# EAGLE design DOORLOCK (EAGLE 7.5.0)
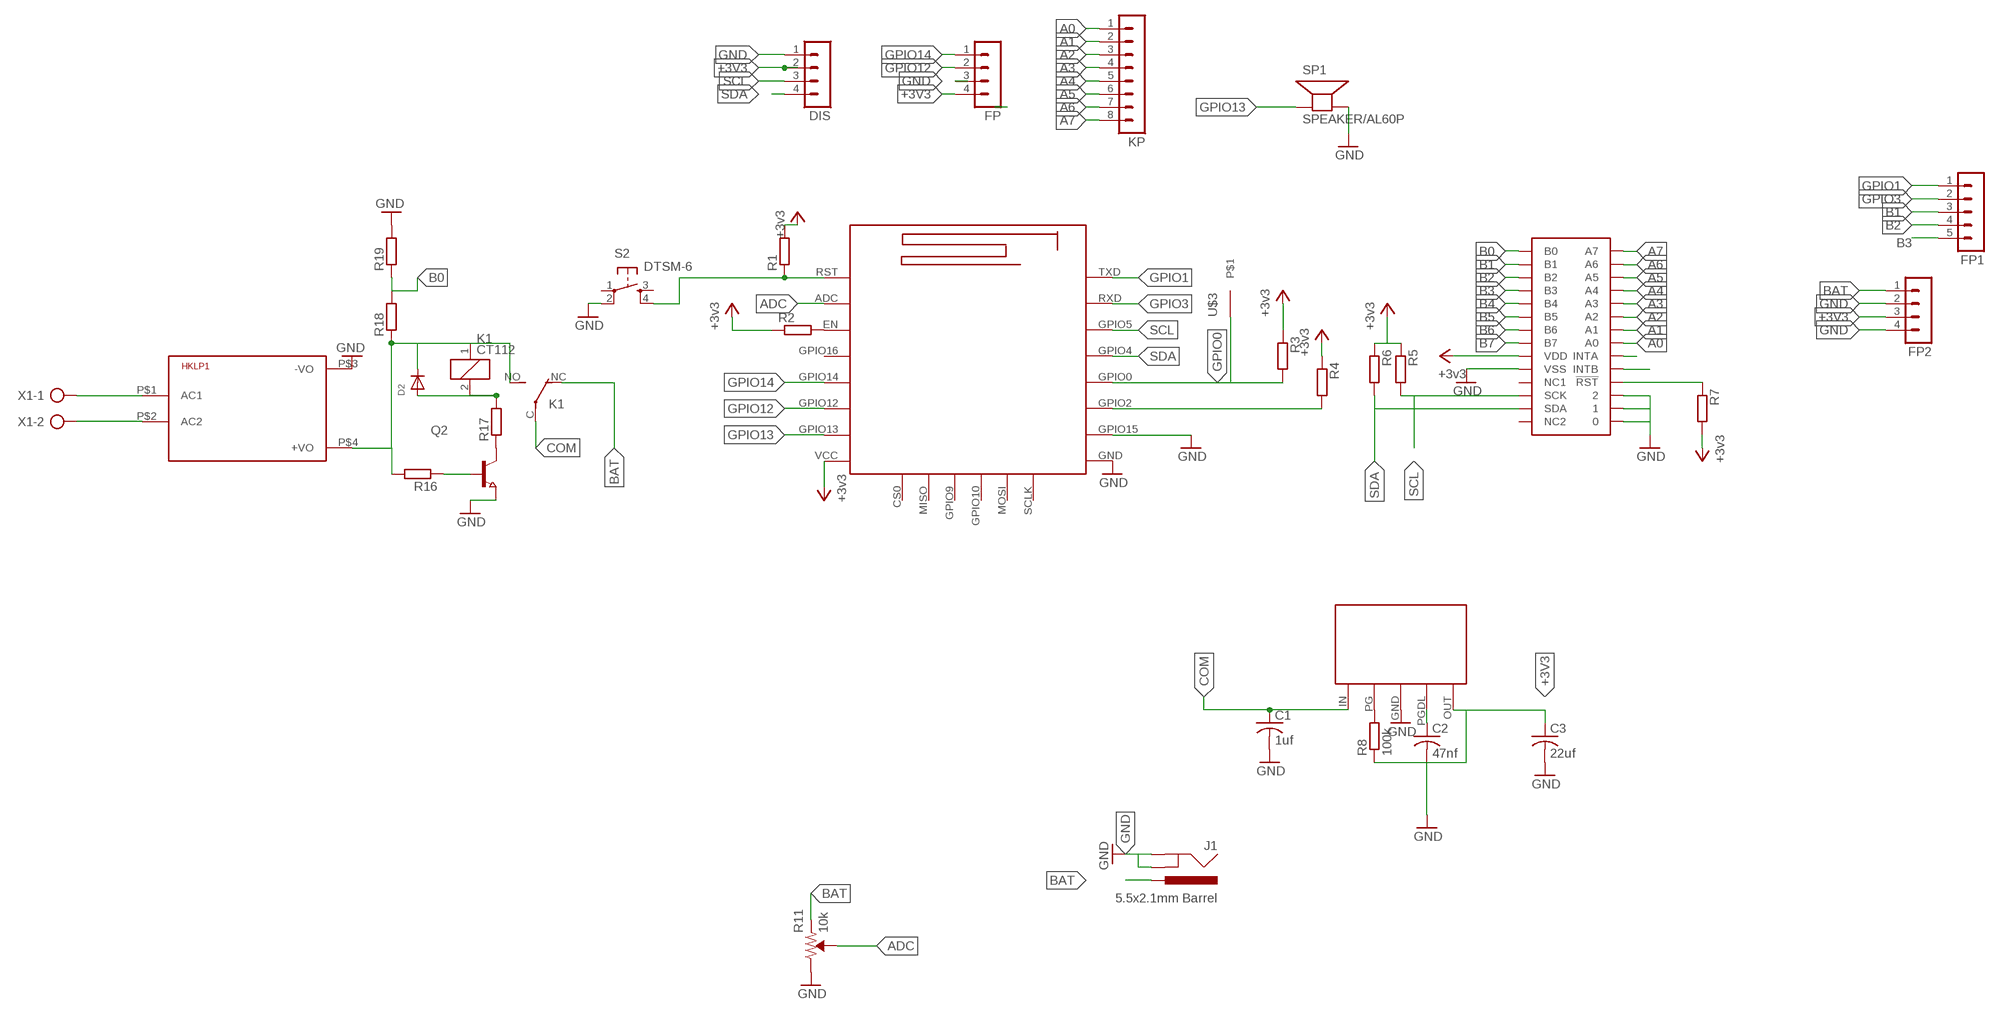
[diagram p0: schematic, sheet 1]

## Parts
C1  1uf  C-USC1206  [C1206]
C2  47nf  C-USC1206  [C1206]
C3  22uf  C-USC1206  [C1206]
D2  DIODESOD-123  [SOD-123]
DIS  MA04-1  [MA04-1]
FP  MA04-1  [MA04-1]
FP1  MA05-1  [MA05-1]
FP2  MA04-1  [MA04-1]
HKLP1  HKLPM01  [HKLPM01]
J1  5.5x2.1mm Barrel  POWER_JACKSMD  [POWER_JACK_SMD]
K1  CT112  [CT-SLIM]
KP  MA08-1  [MA08-1]
Q2  NPN-TRANSISTOR_SOT89  [SOT89]
R1  R-EU_0204/2V  [0204V]
R2  R-EU_0204/2V  [0204V]
R3  R-EU_0204/2V  [0204V]
R4  R-EU_0204/2V  [0204V]
R5  R-EU_0204/2V  [0204V]
R6  R-EU_0204/2V  [0204V]
R7  R-EU_0204/2V  [0204V]
R8  100k  R-EU_0204/2V  [0204V]
R11  10k  TRIMPOT-SMD-3MM-OPEN-1/10W-25%  [TRIMPOT-SMD-TC33X]
R16  R-EU_0204/2V  [0204V]
R17  R-EU_0204/2V  [0204V]
R18  R-EU_0204/2V  [0204V]
R19  R-EU_0204/2V  [0204V]
S2  DTSM-6  [DTSM-6]
SP1  SPEAKER/AL60P  [AL60P]
U$1  ESP12E  [ESP-12E]
U$2  MCF23017  [MAX23017]
U$3  M1  [M1]
U$4  MP2014  [MP2014]
X1  AK500/2-H  [AK500/2-H]

## Nets
+3V3 [GPIO]: C3.1 DIS.2 FP2.3 FP.4 R1.2 R2.1 R3.1 R4.1 R5.1 R6.1 R7.2 R8.1 U$1.VCC U$2.P$9(VDD) U$4.OUT ; supply symbol labelled +3v3
+12V: D2.C HKLP1.P$4(+VO) K1.1 K1.NO(2:S) R16.2 R18.1
A0 [GPIO]: KP.1 U$2.P$21(A0)
A1 [GPIO]: KP.2 U$2.P$22(A1)
A2 [GPIO]: KP.3 U$2.P$23(A2)
A3 [GPIO]: KP.4 U$2.P$24(A3)
A4 [GPIO]: KP.5 U$2.P$25(A4)
A5 [GPIO]: KP.6 U$2.P$26(A5)
A6 [GPIO]: KP.7 U$2.P$27(A6)
A7 [GPIO]: KP.8 U$2.P$28(A7)
ADC [GPIO]: R11.2(WIPER) U$1.ADC
B0 [GPIO]: R18.2 R19.1 U$2.P$1(B0)
B1 [GPIO]: FP1.3 U$2.P$2(B1)
B2 [GPIO]: FP1.4 U$2.P$3(B2)
B3 [GPIO]: FP1.5 U$2.P$4(B3)
B4 [GPIO]: U$2.P$5(B4)
B5 [GPIO]: U$2.P$6(B5)
B6 [GPIO]: U$2.P$7(B6)
B7 [GPIO]: U$2.P$8(B7)
BAT: FP2.1 J1.VIN0(PWR) K1.NC(2:O) R11.3(CCW)
COM: C1.1 K1.C(2:P) U$4.IN
GND [GPIO]: C1.2 C2.2 C3.2 DIS.1 FP2.2 FP2.4 FP.3 HKLP1.P$3(-VO) J1.GND(GNDBREAK) J1.P$4(GND) Q2.3(E) R11.1(CW) R19.2 S2.2 SP1.2(-) U$1.GND U$1.GPIO15 U$2.P$10(VSS) U$2.P$15 U$2.P$16 U$2.P$17 U$4.GND
GPIO0 [GPIO]: R3.2 U$1.GPIO0 U$3.P$1
GPIO1 [GPIO]: FP1.1 U$1.TXD
GPIO3 [GPIO]: FP1.2 U$1.RXD
GPIO12 [GPIO]: FP.2 U$1.GPIO12
GPIO13 [GPIO]: SP1.1(+) U$1.GPIO13
GPIO14 [GPIO]: FP.1 U$1.GPIO14
N$1 [GPIO]: R1.1 S2.4 U$1.RST
N$2: R2.2 U$1.EN
N$3 [AC]: HKLP1.P$1(AC1) X1.1
N$4 [GPIO]: R4.2 U$1.GPIO2
N$7 [AC]: HKLP1.P$2(AC2) X1.2
N$9: R7.1 U$2.P$18(!RST)
N$10: U$2.P$19(INTB)
N$11: U$2.P$20(INTA)
N$12: R8.2 U$4.PG
N$13: C2.1 U$4.PGDL
N$15: Q2.1(B) R16.1
N$16: Q2.2(C) R17.1
N$26: D2.A K1.2 R17.2
SCL [GPIO]: DIS.3 R5.2 U$1.GPIO5 U$2.P$12(SCK)
SDA [GPIO]: DIS.4 R6.2 U$1.GPIO4 U$2.P$13(SDA)
Unconnected: S2.1 S2.3 U$1.CS0 U$1.GPIO9 U$1.GPIO10 U$1.GPIO16 U$1.MISO U$1.MOSI U$1.SCLK U$2.P$11(NC1) U$2.P$14(NC2)

## Library data of the parts
C1-C3 = adafruit:C-US: CAPACITOR, American symbol
D2 = adafruit:DIODE: Diode SMADIODE - SMA Surface Mount Package 20V 1A Schottky Diode Digikey: 641-1014-6-ND DO-1N4148 - Through Hole Small Current Diode SOD-123 20V 1 A (.5mV Vf) Schottky Diode - Digikey: MBRX120TPMSCT-ND SOD-323 10V 570mA (.38mV Vf, 3ns) Schottky Diode - Digikey: ZLLS410CT-ND SOD-523 30V 30mA Schottky Diode (RB751S-40TE61) - Digikey: RB751S-40TE61CT-ND SOT23-R/W - SOT23 Package (R = Solder Paste/Reflow Ovens, W = Hand-Soldering) BAT54Film 40V 300mA - Digikey: 497-7162-1-ND
DIS FP FP2 = con-lstb:MA04-1: PIN HEADER; OC_FARNELL: unknown; OC_NEWARK: unknown
FP1 = con-lstb:MA05-1: PIN HEADER; OC_FARNELL: unknown; OC_NEWARK: unknown
HKLP1 = HKLPM01:HKLPM01
J1 = SparkFun-Connectors:POWER_JACK: Power Jack Connector This is the standard 5.5mm barrel jack for power. The PTH is the most common, proven, reliable, footprint. The Slot footprint only works if the mill layer is transmitted to the PCB fab house so be warned. Here are the connectors we sell at SparkFun: DC Barrel Power Jack/Connector <https://www.sparkfun.com/products/119> (PRT-00119) DC Barrel Power Jack/Connector (SMD) <https://www.sparkfun.com/products/12748> (PRT-12748) DC Barrel Jack Adapter - Breadboard Compatible <https://www.sparkfun.com/products/10811> (PRT-10811) It is used on this SparkFun product (and many, many others): SparkFun RedBoard - Programmed with Arduino <https://www.sparkfun.com/products/12757> (DEV-12757) Also, if you need a mating power supply or connector, please check these out: Wall Adapter Power Supply - 9VDC 650mA <https://www.sparkfun.com/products/298> (TOL-00298) DC Barrel Jack Adapter - Male <https://www.sparkfun.com/products/10287> (PRT-10287); PROD_ID: CONN-08106; SF_ID: PRT-12748
K1 = relay:CT112: ULTRA SMALL AUTOMOTIVE RELAY NAiS Slim 1c type en_ds_61205_0000.pdf; OC_FARNELL: unknown; OC_NEWARK: unknown
KP = con-lstb:MA08-1: PIN HEADER; OC_FARNELL: unknown; OC_NEWARK: unknown
Q2 = semicon-smd-ipc:NPN-TRANSISTOR_: NPN TRANSISTOR
R1-R8 R16-R19 = resistor:R-EU_: RESISTOR, European symbol
R11 = SparkFun-Resistors:TRIMPOT: Trimming Potentiometer (Trimpot) Three-terminal potentiometers, with an adjustable wiper and two adjustable resistors. A pot can be used to create a configurable voltage divider, or as a variable resistor. "Trimpots" are a subset of potentiometers, usually intended for "set-and-forget" applications. They're often more delicate than standard potentiometers - rated for fewer turns. Variants PTH-KNOB - PTH Trimpot w/ finger-adjustable knob Trimpot 10K with Knob <https://www.sparkfun.com/products/9806> (COM-09806) Datasheet <http://www.sparkfun.com/datasheets/Components/General/TSR-3386.pdf> SMD-3MM-CLOSED-FRAME - SMD 3mm Square Closed-Frame Trimpot Used on e.g. EasyDriver - Stepper Motor Driver <https://www.sparkfun.com/products/12779> Datasheet <http://www.bitechnologies.com/pdfs/22.pdf> (22AR10KTR) SMD-5MM - SMD 5mm Square Closed-Frame Trimpot Used on e.g. IOIO-OTG - V2.2 <https://www.sparkfun.com/products/13613> Datasheet <http://www.vishay.com/docs/51008/ts53.pdf> (TS53YL502MR10) SMD-3MM-1/10W-25% - 3mm Square Open-Frame Trimpot Used on e.g. SparkFun Shapeoko <https://www.sparkfun.com/products/13899> Datasheet <http://www.bourns.com/docs/Product-Datasheets/TC33.pdf> (TC33X-2-103E); PROD_ID: RES-12428, RES-08048
S2 = switch-tact:DTSM-6
SP1 = adafruit:SPEAKER: SPEAKER Source: Buerklin Added PS12 (for part # PS1240 piezo) http://www.ladyada.net/library/pcb/eaglelibrary.html
U$1 = Alfred:ESP12E
U$2 = Alfred:MCF23017
U$3 = Alfred:M1
U$4 = Alfred:MP2014
X1 = con-ptr500:AK500/2-H: CONNECTOR Aug. 2004 / PTR Meßtechnik: Die Bezeichnung der Serie AK505 wurde geändert. Es handelt sich hierbei um AK500 in horizontaler Ausführung.; OC_FARNELL: unknown; OC_NEWARK: unknown

## Net classes
0 default: width 0.5 mm, drill 0.4 mm, clearance 0.2 mm
1 AC: width 1 mm, drill 0.4 mm, clearance 1 mm to class 0, clearance 1 mm
2 GPIO: width 0.2 mm, drill 0.4 mm, clearance 0.2 mm to class 0, clearance 1 mm to class 1, clearance 0.2 mm

## Board
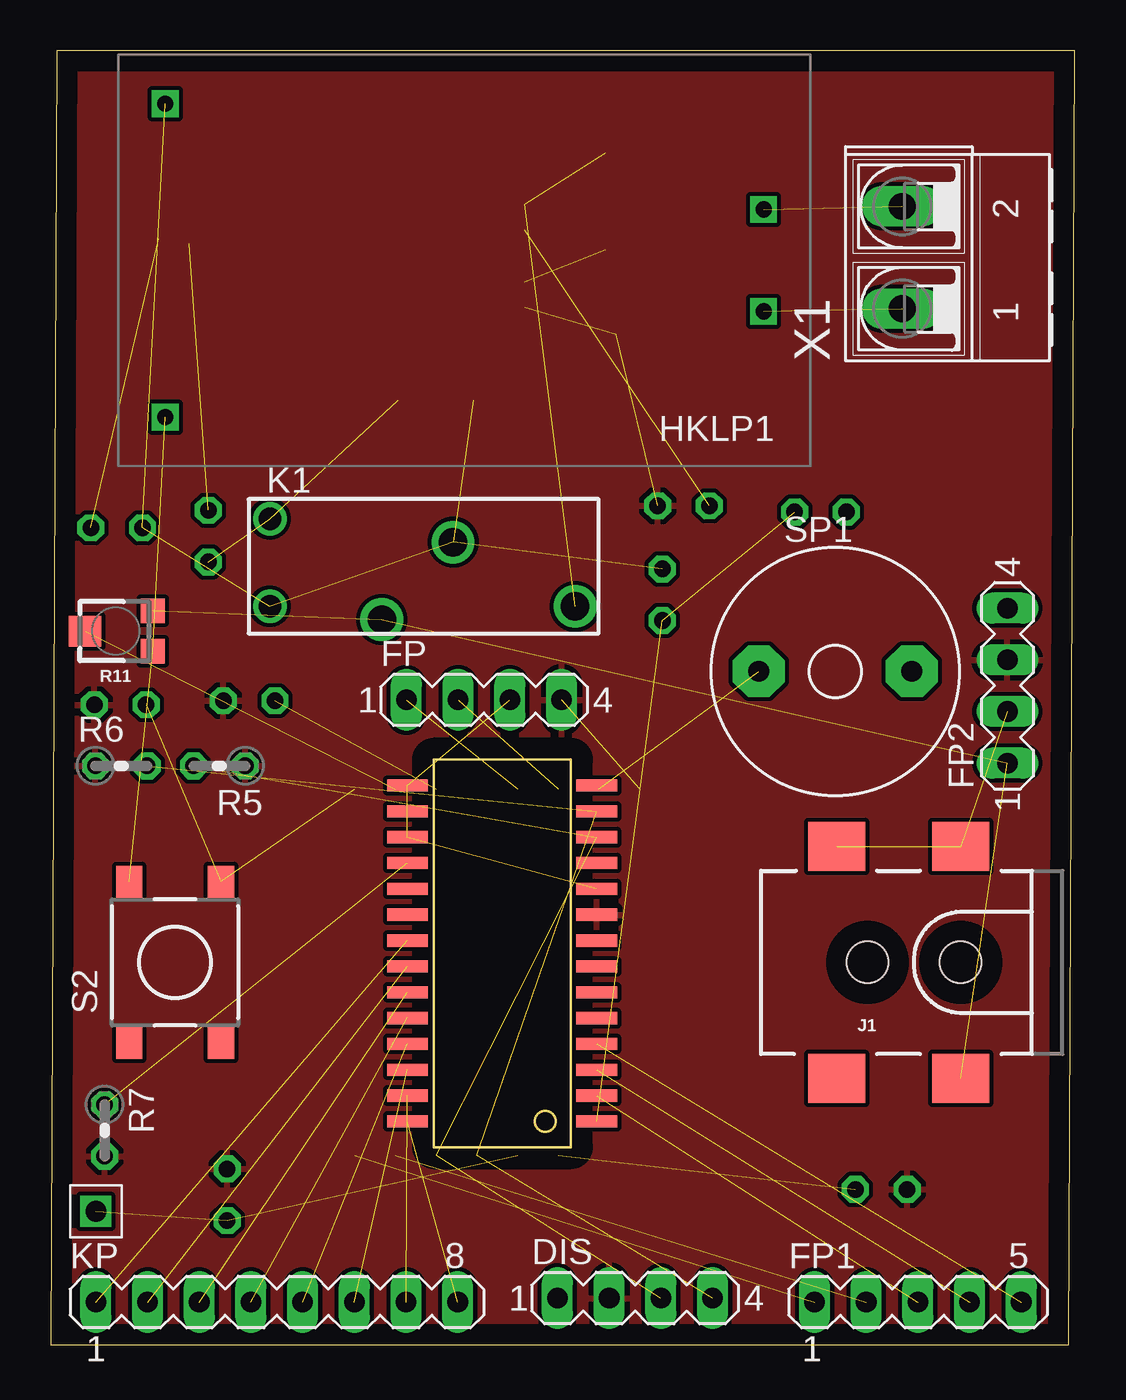
[diagram p1: board, top side]
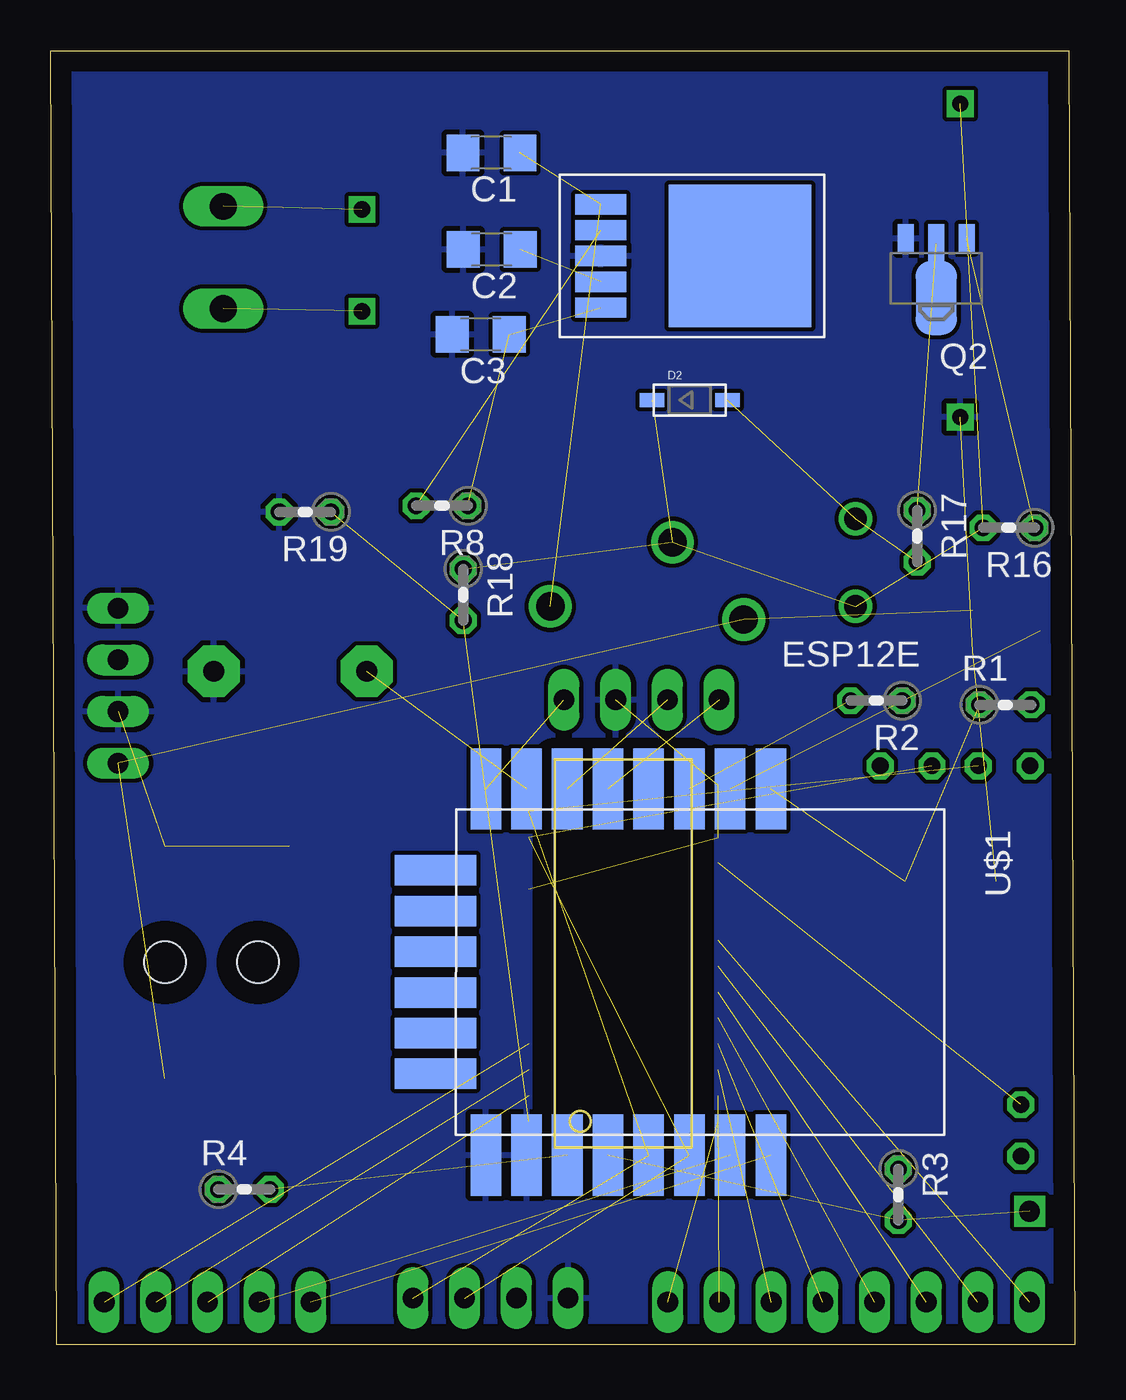
[diagram p2: board, bottom side, seen from below]

Size 50.3 x 63.6 mm. Coordinates in mm from the lower left corner, seen from the top.
Outline: 0,0 50,0 50.3,63.6 0.3,63.6 0,0
Copper layers (1*16): Top 0.035mm / dielectric 1.5mm / Bottom 0.035mm
Design rules "default": minimum track width 10mil, minimum drill 24mil, track to track 8mil, track to pad 8mil, pad to pad 8mil, via to via 8mil, smd to smd 8mil, copper to edge 40mil, drill to drill 8mil, minimum pad ring 10mil, minimum via ring 8mil, stop-mask expansion 4mil, vias tented up to drill 0mil, thermal gap 10mil
Holes 3 mm at 59,75 66,72

### Footprints (pad centres in the part's own frame; a part is rotated, then mirrored left to right if it is on the bottom)
C1206 = smd 1.6 x 1.8: 1 -1.4,0; 2 1.4,0
SOD-123 = smd 1.2 x 0.7: A 1.85,0; C -1.85,0
MA04-1 = drill 1.016 long: 1 -3.81,0; 2 -1.27,0; 3 1.27,0; 4 3.81,0
MA05-1 = drill 1.016 long: 1 -5.08,0; 2 -2.54,0; 3 0,0; 4 2.54,0; 5 5.08,0
HKLPM01 = drill 0.8 square: P$1 -14.7,2.5; P$2 -14.7,-2.5; P$3 14.7,7.7; P$4 14.7,-7.7
POWER_JACK_SMD = smd 2.8 x 2.4: GND 0,-5.7; P$4 6.1,-5.7; VIN0 0,5.7; VIN1 6.1,5.7 | hole 2.032: 0,0; 4.572,0
CT-SLIM = drill 1.1: 1 -7.45,0; 2 -7.45,4.3 | drill 1.4: C 7.55,0; NC -1.95,-0.65; NO 1.55,3.15
MA08-1 = drill 1.016 long: 1 -8.89,0; 2 -6.35,0; 3 -3.81,0; 4 -1.27,0; 5 1.27,0; 6 3.81,0; 7 6.35,0; 8 8.89,0
SOT89 = smd 0.8 x 1.4: 1 -1.499,-1.981; 3 1.499,-1.981 | smd 0.8 x 1.9: 2 0,-1.727 | smd 2.032 x 3.65: 2@1 0,0.94
0204V = drill 0.813 octagon: 1 -1.27,0; 2 1.27,0
TRIMPOT-SMD-TC33X = smd 1.2 x 1.2: 1 -1,-1.825; 3 1,-1.825 | smd 1.5 x 1.6: 2 0,1.5
DTSM-6 = smd 1.55 x 1.3: 1 -3.975,2.25; 2 3.975,2.25; 3 -3.975,-2.25; 4 3.975,-2.25
AL60P = drill 1.016 pad 2.54 octagon: 1 -3.759,0; 2 3.759,0
ESP-12E = smd 4 x 1.5: ADC -1,13.48; EN -1,11.48; GND 17,1.48; GPIO0 17,7.48; GPIO2 17,5.48; GPIO4 17,9.48; GPIO5 17,11.48; GPIO12 -1,5.48; GPIO13 -1,3.48; GPIO14 -1,7.48; GPIO15 17,3.48; GPIO16 -1,9.48; RST -1,15.48; RXD 17,13.48; TXD 17,15.48; VCC -1,1.48 | smd 1.5 x 4: CS0 3,-1; GPIO9 7,-1; GPIO10 9,-1; MISO 5,-1; MOSI 11,-1; SCLK 13,-1
MAX23017 = smd 0.6 x 2: P$1 0,0; P$2 1.27,0; P$3 2.54,0; P$4 3.81,0; P$5 5.08,0; P$6 6.35,0; P$7 7.62,0; P$8 8.89,0; P$9 10.16,0; P$10 11.43,0; P$11 12.7,0; P$12 13.97,0; P$13 15.24,0; P$14 16.51,0; P$15 16.51,9.3; P$16 15.24,9.3; P$17 13.97,9.3; P$18 12.7,9.3; P$19 11.43,9.3; P$20 10.16,9.3; P$21 8.89,9.3; P$22 7.62,9.3; P$23 6.35,9.3; P$24 5.08,9.3; P$25 3.81,9.3; P$26 2.54,9.3; P$27 1.27,9.3; P$28 0,9.3
M1 = drill 1.016 square: P$1 0,0
MP2014 = smd 1 x 2.5: GND 0,0; IN -2.54,0; OUT 2.54,0; PG -1.27,0; PGDL 1.27,0 | smd 7 x 7: P$6 0,6.85
AK500/2-H = drill 1.321 long: 1 -2.515,0; 2 2.515,0

### Placement (x,y rotation side)
C1  28.66,58.59 180 bottom
C2  28.64,53.84 180 bottom
C3  29.18,49.66 180 bottom
D2  18.91,46.44 0 bottom
DIS  28.7,2.3 0 top
FP  21.28,31.7 0 top
FP1  42.6,2.1 0 top
FP2  47,32.4 90 top
HKLP1  20.32,53.3 180 top
J1  44.7,18.8 180 top
K1  18.21,36.3 0 top
KP  11.1,2.1 0 top
Q2  6.8,52.4 180 bottom
R1  3.41,31.46 0 bottom
R2  9.74,31.66 180 bottom
R3  8.66,7.38 270 bottom
R4  40.8,7.64 0 bottom
R5  8.28,28.46 180 top
R6  3.46,28.46 0 top
R7  2.64,10.54 270 top
R8  31.08,41.24 180 bottom
R11  3.18,35.08 90 top
R16  3.23,40.16 180 bottom
R17  7.74,39.75 270 bottom
R18  30.04,36.87 270 bottom
R19  37.81,40.94 180 bottom
S2  6.1,18.8 90 top
SP1  38.54,33.1 0 top
U$1  30.41,26.32 270 bottom
U$2  26.82,10.98 90 top
U$3  2.21,6.56 180 top
U$4  23.29,53.52 270 bottom
X1  41.83,53.44 90 top

### Tracks (layer width: path | path; a pad name or v marks a point on that pad's centre or on a via)
+3V3  (3 unrouted)
  pour Top: 0.3,63.6 50.3,63.6 50,0 0,0
+12V  (5 unrouted)
A0  (1 unrouted)
A1  (1 unrouted)
A2  (1 unrouted)
A3  (1 unrouted)
A4  (1 unrouted)
A5  (1 unrouted)
A6  (1 unrouted)
A7  (1 unrouted)
ADC  (1 unrouted)
B0  (2 unrouted)
B1  (1 unrouted)
B2  (1 unrouted)
B3  (1 unrouted)
BAT  (3 unrouted)
COM  (2 unrouted)
GND  (8 unrouted)
  pour Bottom: 0,63.4 50,63.4 50,0 0,0
GPIO0  (2 unrouted)
GPIO1  (1 unrouted)
GPIO3  (1 unrouted)
GPIO12  (1 unrouted)
GPIO13  (1 unrouted)
GPIO14  (1 unrouted)
N$1  (2 unrouted)
N$2  (1 unrouted)
N$3  (1 unrouted)
N$4  (1 unrouted)
N$7  (1 unrouted)
N$9  (1 unrouted)
N$12  (1 unrouted)
N$13  (1 unrouted)
N$15  (1 unrouted)
N$16  (1 unrouted)
N$26  (2 unrouted)
SCL  (3 unrouted)
SDA  (3 unrouted)